# Altium project Odrive_input.PrjPcb
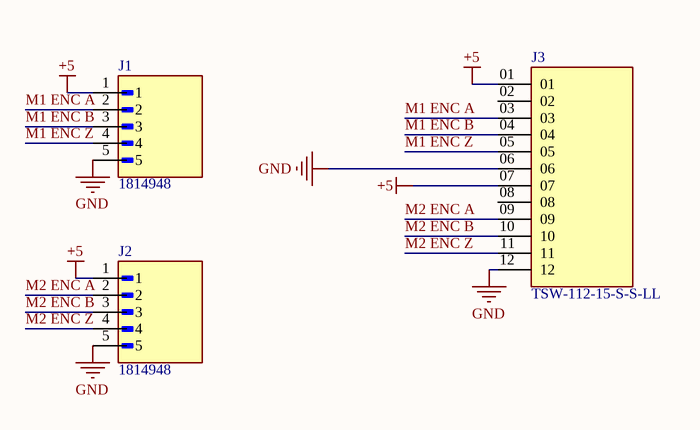
[diagram p0: MAIN.SchDoc]
1 sheet, 3 parts. Net scope: global (net labels, ports and power ports of the same name join across sheets).
Board file: Odrive_input.PcbDoc

## Sheet MAIN.SchDoc
size A4; SheetNumber: 1; SheetTotal: 1

### Parts
J1  1814948  [PHOENIX_1814948]
J2  1814948  [PHOENIX_1814948]
J3  TSW-112-15-S-S-LL  [SAMTEC_TSW-112-15-S-S-LL]

### Nets
+5: J1.1 J2.1 J3.01 J3.07
GND: J1.5 J2.5 J3.06 J3.12
M1 ENC A: J1.2 J3.03
M1 ENC B: J1.3 J3.04
M1 ENC Z: J1.4 J3.05
M2 ENC A: J2.2 J3.09
M2 ENC B: J2.3 J3.10
M2 ENC Z: J2.4 J3.11

Not connected (* = marked no-connect by the designer): J3 02 08

### Library data of the parts
J1 J2 = CMP-002-00078-1: MP: 1814948; Availability: Unavailable; Price: None; Component Type: Standard; Source: 1814948.SchLib; Value: *; Design Item ID: 1814948; Case/Package: None; Pins: 5
J3 = CMP-002-00079-1: Availability: Unavailable; Source: TSW-112-15-S-S-LL.SchLib; Price: None; Component Type: Standard; Design Item ID: TSW-112-15-S-S-LL; Value: *; MP: TSW-112-15-S-S-LL; Pins: 12; Case/Package: None